# EAGLE design sterownik_RC (EAGLE 7.2.0)
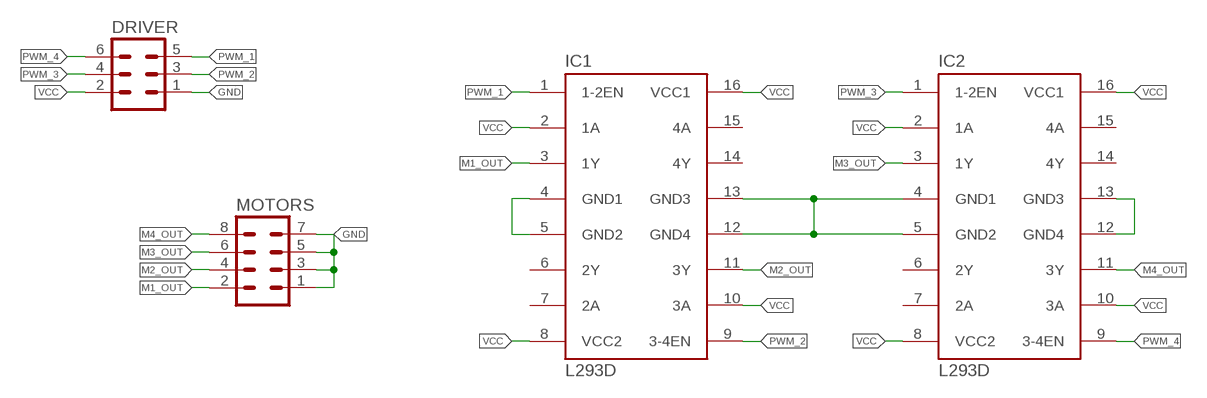
[diagram p0: schematic, sheet 1]

## Parts
DRIVER  MA03-2  [MA03-2]
IC1  L293D  [DIL16]
IC2  L293D  [DIL16]
MOTORS  MA04-2  [MA04-2]

## Nets
GND: DRIVER.1 IC1.4(GND1) IC1.5(GND2) IC1.12(GND4) IC1.13(GND3) IC2.4(GND1) IC2.5(GND2) IC2.12(GND4) IC2.13(GND3) MOTORS.1 MOTORS.3 MOTORS.5 MOTORS.7
M1_OUT: IC1.3(1Y) MOTORS.2
M2_OUT: IC1.11(3Y) MOTORS.4
M3_OUT: IC2.3(1Y) MOTORS.6
M4_OUT: IC2.11(3Y) MOTORS.8
PWM_1: DRIVER.5 IC1.1(1-2EN)
PWM_2: DRIVER.3 IC1.9(3-4EN)
PWM_3: DRIVER.4 IC2.1(1-2EN)
PWM_4: DRIVER.6 IC2.9(3-4EN)
VCC: DRIVER.2 IC1.2(1A) IC1.8(VCC2) IC1.10(3A) IC1.16(VCC1) IC2.2(1A) IC2.8(VCC2) IC2.10(3A) IC2.16(VCC1)
Unconnected: IC1.6(2Y) IC1.7(2A) IC1.14(4Y) IC1.15(4A) IC2.6(2Y) IC2.7(2A) IC2.14(4Y) IC2.15(4A)

## Library data of the parts
DRIVER = con-lstb:MA03-2: PIN HEADER; OC_FARNELL: unknown; OC_NEWARK: unknown
IC1 IC2 = st-microelectronics:L293D: PUSH-PULL 4 CHANNEL DRIVER; MPN: L293D; OC_FARNELL: 9589619; OC_NEWARK: 56P8249
MOTORS = con-lstb:MA04-2: PIN HEADER; OC_FARNELL: unknown; OC_NEWARK: unknown

## Board
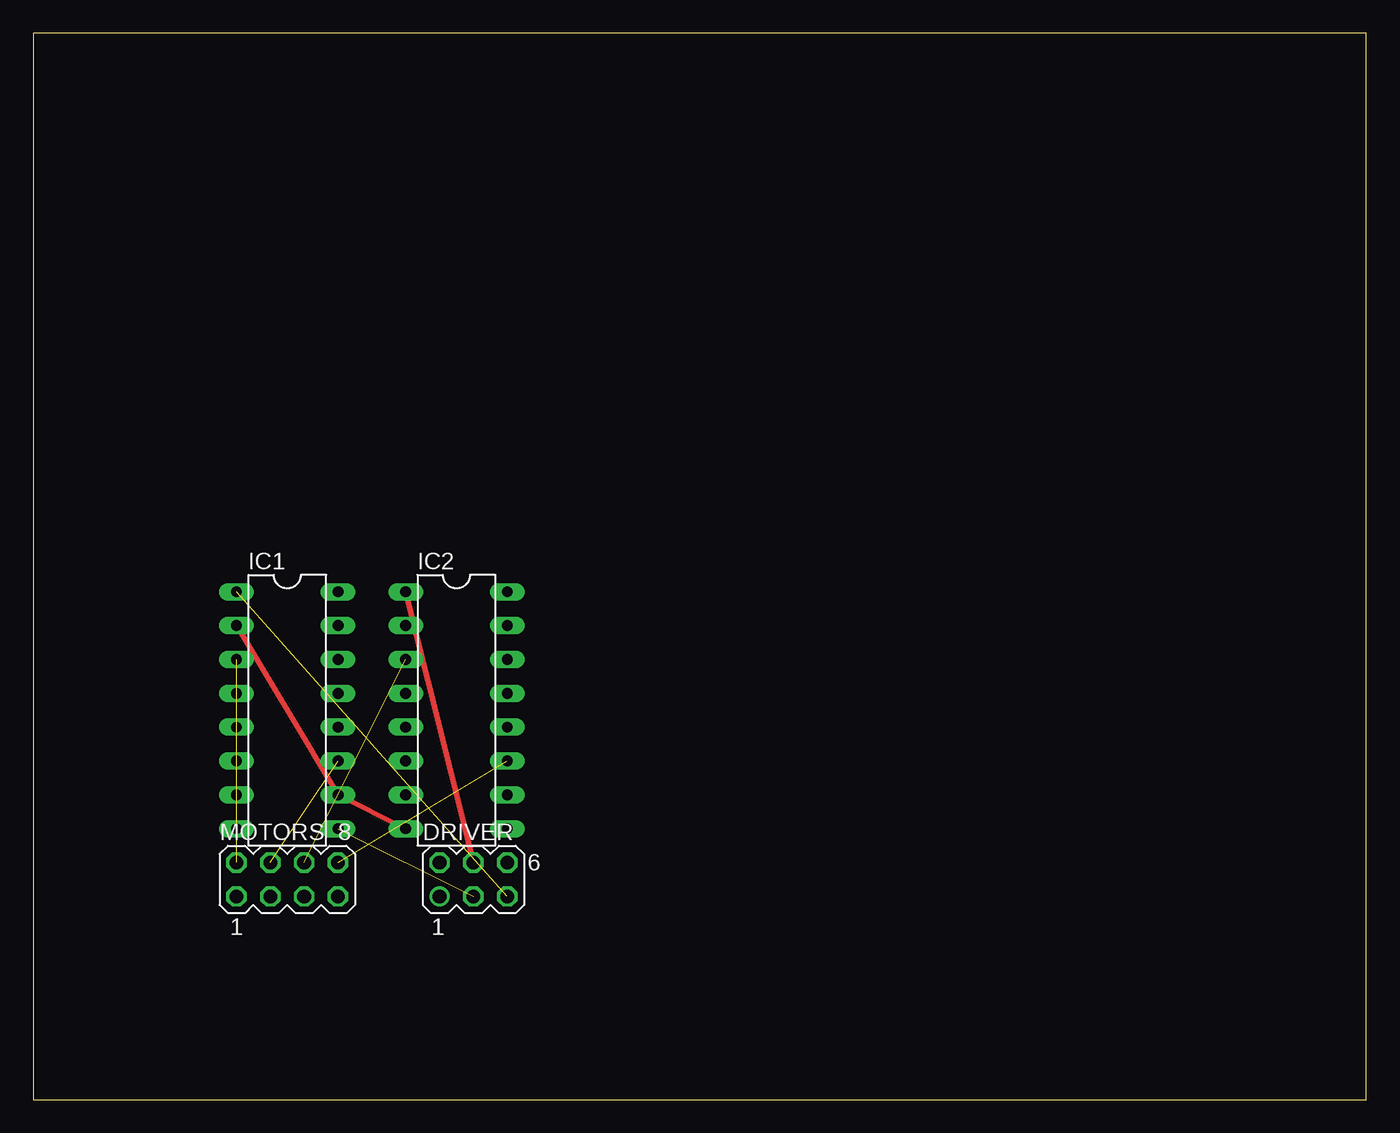
[diagram p1: board, top side]
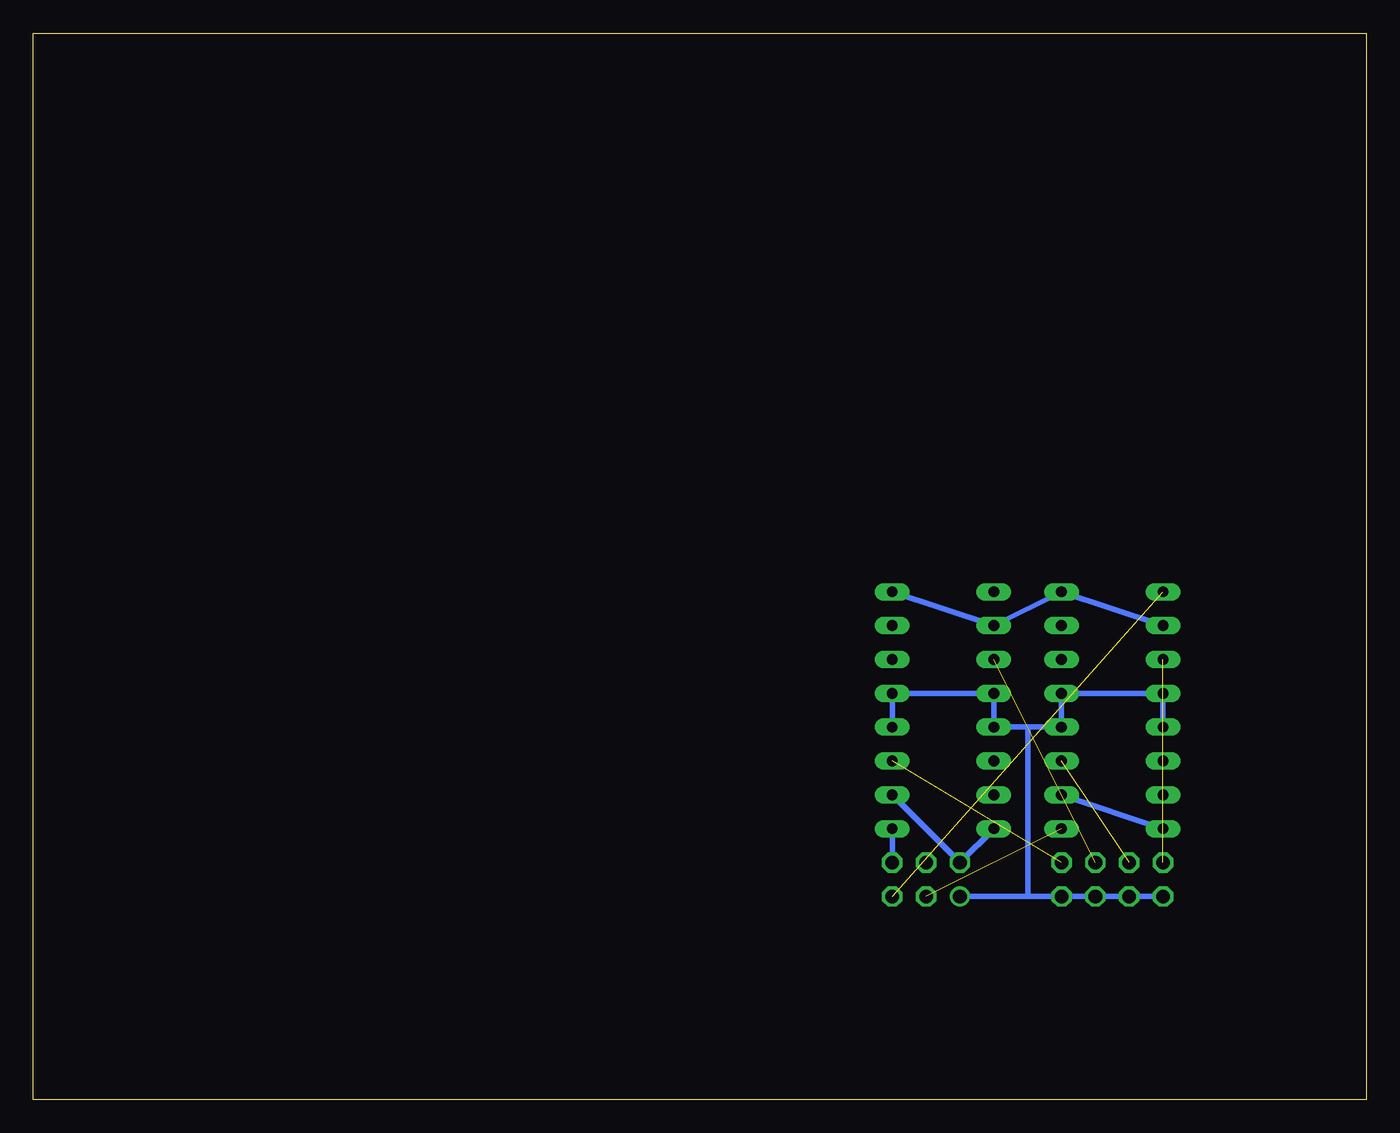
[diagram p2: board, bottom side, seen from below]

Size 100 x 80 mm. Coordinates in mm from the lower left corner, seen from the top.
Outline: 0,0 100,0 100,80 0,80 0,0
Copper layers (1*16): Top 0.035mm / dielectric 1.5mm / Bottom 0.035mm
Design rules "default": minimum track width 10mil, minimum drill 24mil, track to track 8mil, track to pad 8mil, pad to pad 8mil, via to via 8mil, smd to smd 8mil, copper to edge 40mil, drill to drill 8mil, minimum pad ring 10mil, minimum via ring 8mil, stop-mask expansion 4mil, vias tented up to drill 0mil, thermal gap 10mil

### Footprints (pad centres in the part's own frame; a part is rotated, then mirrored left to right if it is on the bottom)
MA03-2 = drill 1.016: 1 -2.54,-1.27 | drill 1.016 octagon: 2 -2.54,1.27; 3 0,-1.27; 4 0,1.27; 5 2.54,-1.27; 6 2.54,1.27
DIL16 = drill 0.813 long: 1 -8.89,-3.81; 2 -6.35,-3.81; 3 -3.81,-3.81; 4 -1.27,-3.81; 5 1.27,-3.81; 6 3.81,-3.81; 7 6.35,-3.81; 8 8.89,-3.81; 9 8.89,3.81; 10 6.35,3.81; 11 3.81,3.81; 12 1.27,3.81; 13 -1.27,3.81; 14 -3.81,3.81; 15 -6.35,3.81; 16 -8.89,3.81
MA04-2 = drill 1.016 octagon: 1 -3.81,-1.27; 2 -3.81,1.27; 3 -1.27,-1.27; 4 -1.27,1.27; 5 1.27,-1.27; 6 1.27,1.27; 7 3.81,-1.27; 8 3.81,1.27

### Placement (x,y rotation side)
DRIVER  33.02,16.51 0 top
IC1  19.05,29.21 270 top
IC2  31.75,29.21 270 top
MOTORS  19.05,16.51 0 top

### Tracks (layer width: path | path; a pad name or v marks a point on that pad's centre or on a via)
GND
  Bottom 0.406: IC1.5 IC1.4 IC1.13 IC1.12 25.4,27.94 | MOTORS.1 MOTORS.3 MOTORS.5 MOTORS.7 25.4,15.24 | 25.4,15.24 DRIVER.1 | 25.4,27.94 IC2.5 IC2.4 IC2.13 IC2.12 | 25.4,15.24 25.4,27.94
M1_OUT  (1 unrouted)
M2_OUT  (1 unrouted)
M3_OUT  (1 unrouted)
M4_OUT  (1 unrouted)
PWM_1  (1 unrouted)
PWM_2  (1 unrouted)
PWM_3
  Top 0.406: DRIVER.4 IC2.1
PWM_4
  Bottom 0.406: DRIVER.6 IC2.9
VCC
  Top 0.406: IC2.8 IC1.10 IC1.2
  Bottom 0.406: IC1.2 IC1.16 IC2.2 IC2.16 | IC2.8 DRIVER.2 IC2.10 | IC1.10 IC1.8